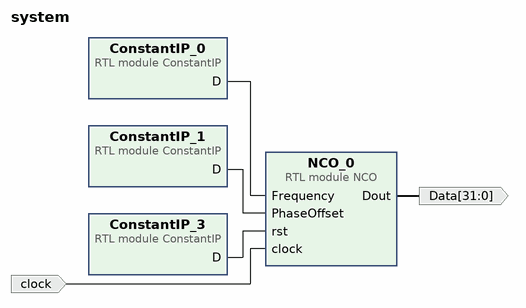
[diagram p0: block diagram of the top level]
# Vivado block design system, xc7z010clg400-1, Vivado 2022.2
create_bd_design system

create_bd_port -dir I -type clk clock
set_property -dict {CONFIG.FREQ_HZ 100000000} [get_bd_ports clock]
create_bd_port -dir O -from 31 -to 0 -type data Data

create_bd_cell -type module -reference ConstantIP ConstantIP_0
set_property -dict {CONFIG.OutputConstant 150000000 CONFIG.OutputSize 32} [get_bd_cells ConstantIP_0]
create_bd_cell -type module -reference ConstantIP ConstantIP_1
set_property -dict {CONFIG.OutputSize 32} [get_bd_cells ConstantIP_1]
create_bd_cell -type module -reference ConstantIP ConstantIP_3
set_property -dict {CONFIG.OutputSize 1} [get_bd_cells ConstantIP_3]
create_bd_cell -type module -reference NCO NCO_0
set_property -dict {CONFIG.ADC_SIZE 32 CONFIG.ROM_Size 12} [get_bd_cells NCO_0]

# ---- connections ----

connect_bd_net [get_bd_pins ConstantIP_0/D] [get_bd_pins NCO_0/Frequency]
connect_bd_net [get_bd_pins ConstantIP_1/D] [get_bd_pins NCO_0/PhaseOffset]
connect_bd_net [get_bd_pins NCO_0/Dout] [get_bd_ports Data]
connect_bd_net [get_bd_pins ConstantIP_3/D] [get_bd_pins NCO_0/rst]
connect_bd_net [get_bd_ports clock] [get_bd_pins NCO_0/clock]

validate_bd_design
save_bd_design
